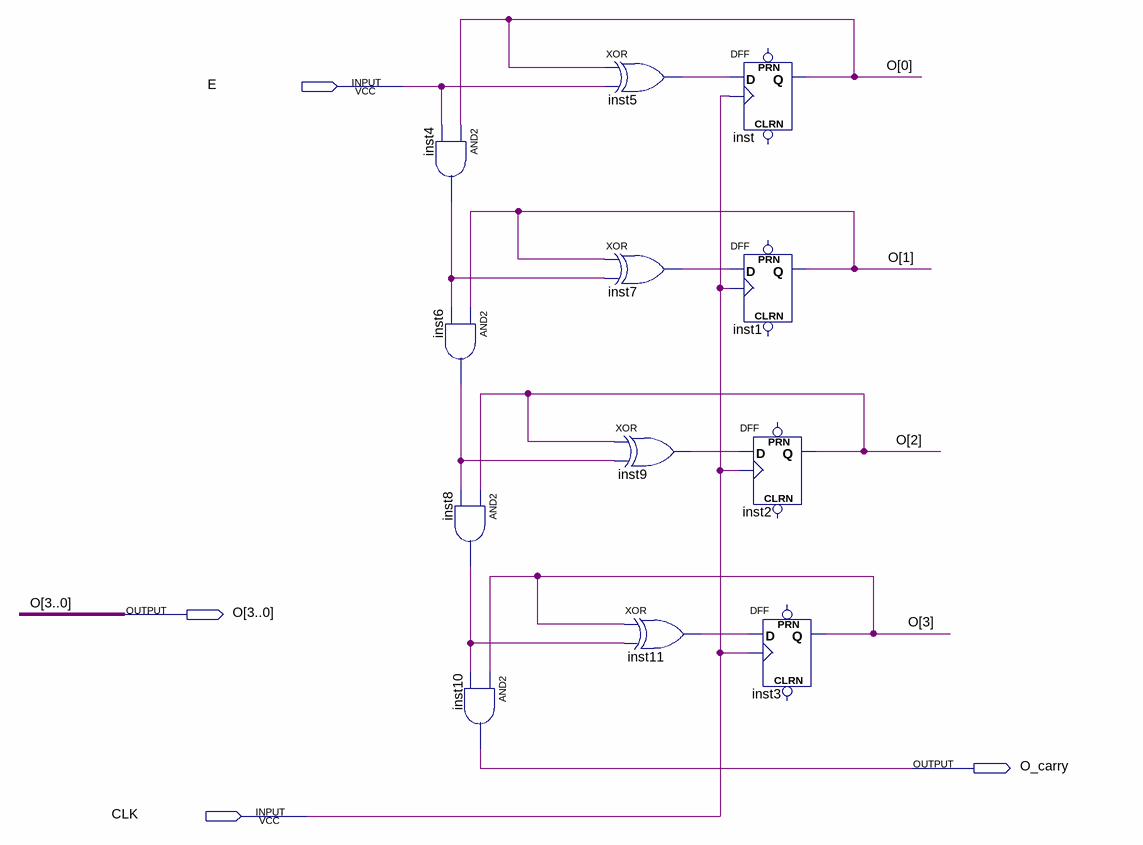
[diagram p0: schematic sheet]
// Quartus schematic Counter.bdf as structural Verilog: 12 symbols, 4 pins
module Counter (
  input  E,
  input  CLK,
  output [3:0] O,
  output O_carry
);

  wire inst4_out, inst5_out, inst6_out, inst7_out, inst8_out, inst9_out, inst11_out;

  and inst4 (inst4_out, O[0], E);
  and inst6 (inst6_out, O[1], inst4_out);
  and inst8 (inst8_out, O[2], inst6_out);
  and inst10 (O_carry, O[3], inst8_out);
  xor inst5 (inst5_out, O[0], E);
  xor inst7 (inst7_out, O[1], inst4_out);
  xor inst9 (inst9_out, O[2], inst6_out);
  xor inst11 (inst11_out, O[3], inst8_out);
  DFF inst (.CLK(CLK), .D(inst5_out), .Q(O[0]));  // open: CLRN, PRN
  DFF inst1 (.CLK(CLK), .D(inst7_out), .Q(O[1]));  // open: CLRN, PRN
  DFF inst2 (.CLK(CLK), .D(inst9_out), .Q(O[2]));  // open: CLRN, PRN
  DFF inst3 (.CLK(CLK), .D(inst11_out), .Q(O[3]));  // open: CLRN, PRN
endmodule
